# EasyEDA Pro project ProPrj_STM32电源板第二版_2025-04-22.epro, schematic Schematic1
Board Name: Board1; Create Date: 2025-03-05; Page Name: P1; Project Name: STM32电源板第二版; Schematic Name: Schematic1; Update Date: 2025-04-17; Company: 嘉立创EDA; Page Size: A4; Version: V1.0
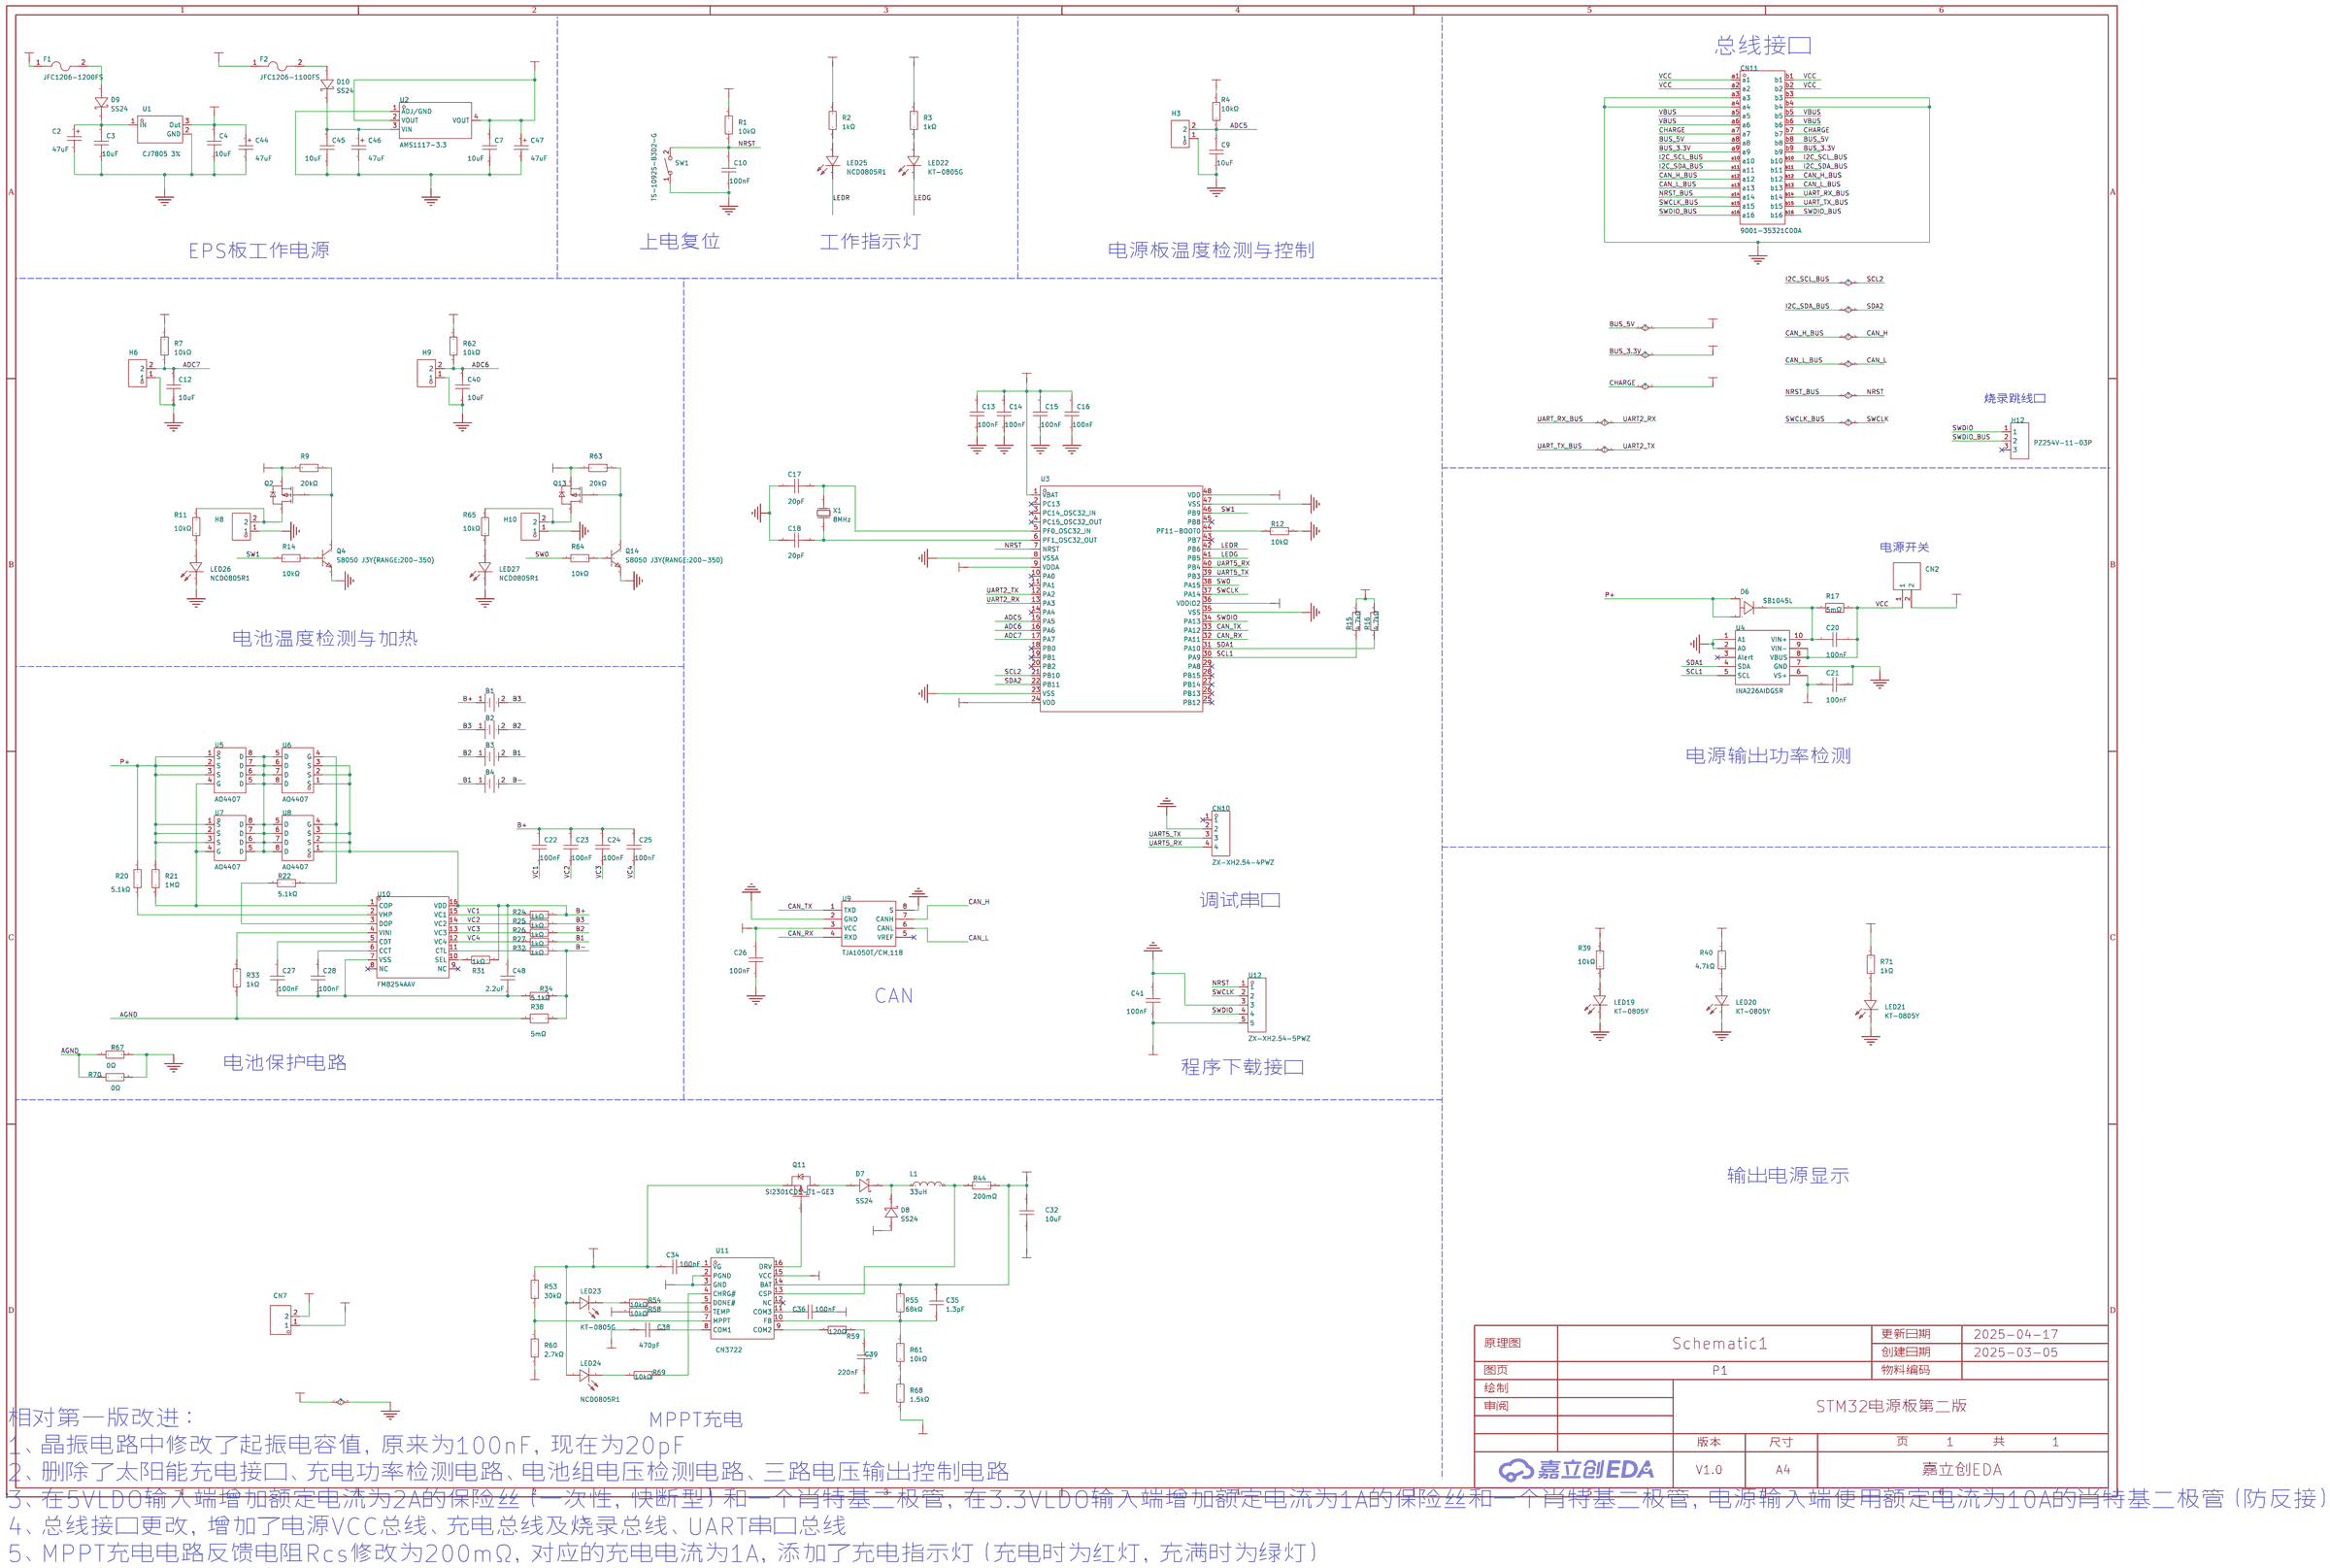
[diagram p0: schematic sheet]

## Parts
B1  -  [18650_ZHIHAN]
B2  -  [18650_ZHIHAN]
B3  -  [18650_ZHIHAN]
B4  -  [18650_ZHIHAN]
C2  47uF  [CASE-D_7343]
C3  10uF  [C0603]
C4  10uF  [C0603]
C7  10uF  [C0603]
C9  10uF  [C0603]
C10  100nF  [C0603]
C12  10uF  [C0603]
C13  100nF  [C0603]
C14  100nF  [C0603]
C15  100nF  [C0603]
C16  100nF  [C0603]
C17  20pF  [C0603]
C18  20pF  [C0603]
C20  100nF  [C0603]
C21  100nF  [C0603]
C22  100nF  [C0603]
C23  100nF  [C0603]
C24  100nF  [C0603]
C25  100nF  [C0603]
C26  100nF  [C0603]
C27  100nF  [C0603]
C28  100nF  [C0603]
C32  10uF  [C0603]
C34  100nF  [C0603]
C35  1.3pF  [C0603]
C36  100nF  [C0603]
C38  470pF  [C0603]
C39  220nF  [C0603]
C40  10uF  [C0603]
C41  100nF  [C0603]
C44  47uF  [CASE-D_7343]
C45  10uF  [C0603]
C46  47uF  [CASE-D_7343]
C47  47uF  [CASE-D_7343]
C48  2.2uF  [C0805]
CN2  WJ2EDGRC-5.08-2P  [CONN-TH_2P-P5.08_WJ2EDGRC-5.08-2P]
CN7  WJ15EDGRC-3.81-2P  [CONN-TH_2P-P3.81_WJ15EDGRC-3.81-2P]
CN10  ZX-XH2.54-4PWZ  [CONN-TH_4P-P2.50_ZX-XH2.54-4PWZ]
CN11  9001-35321C00A  [CONN-TH_32P-P2.54_9001-35321C00A]
D6  SB1045L  [TO-277_3P-L5.4-W4.0-LS6.5-TR]
D7  SS24  [SMA_L4.3-W2.6-LS5.0-FD]
D8  SS24  [SMA_L4.3-W2.6-LS5.0-FD]
D9  SS24  [SMA_L4.3-W2.6-LS5.0-FD]
D10  SS24  [SMA_L4.3-W2.6-LS5.0-FD]
F1  JFC1206-1200FS  [F1206]
F2  JFC1206-1100FS  [F1206]
H3  PZ254V-11-02P  [HDR-TH_2P-P2.54-V-M]
H6  PZ254V-11-02P  [HDR-TH_2P-P2.54-V-M]
H8  PZ254V-11-02P  [HDR-TH_2P-P2.54-V-M]
H9  PZ254V-11-02P  [HDR-TH_2P-P2.54-V-M]
H10  PZ254V-11-02P  [HDR-TH_2P-P2.54-V-M]
H12  PZ254V-11-03P  [HDR-TH_3P-P2.54-V-M]
L1  33uH  [IND-SMD_L7.0-W6.6_FXL0630]
LED19  KT-0805Y  [LED0805-R-RD]
LED20  KT-0805Y  [LED0805-R-RD]
LED21  KT-0805Y  [LED0805-R-RD]
LED22  KT-0805G  [LED0805-R-RD]
LED23  KT-0805G  [LED0805-R-RD]
LED24  NCD0805R1  [LED0805-R-RD]
LED25  NCD0805R1  [LED0805-R-RD]
LED26  NCD0805R1  [LED0805-R-RD]
LED27  NCD0805R1  [LED0805-R-RD]
Q2  SI2301CDS-T1-GE3  [SOT-23-3_L3.0-W1.7-P0.95-LS2.9-BR]
Q4  S8050 J3Y(RANGE:200-350)  [SOT-23-3_L3.0-W1.7-P0.95-LS2.9-BR]
Q11  SI2301CDS-T1-GE3  [SOT-23-3_L3.0-W1.7-P0.95-LS2.9-BR]
Q13  SI2301CDS-T1-GE3  [SOT-23-3_L3.0-W1.7-P0.95-LS2.9-BR]
Q14  S8050 J3Y(RANGE:200-350)  [SOT-23-3_L3.0-W1.7-P0.95-LS2.9-BR]
R1  10kΩ  [R0603]
R2  1kΩ  [R0603]
R3  1kΩ  [R0603]
R4  10kΩ  [R0603]
R7  10kΩ  [R0603]
R9  20kΩ  [R0603]
R11  10kΩ  [R0603]
R12  10kΩ  [R0603]
R14  10kΩ  [R0603]
R15  4.7kΩ  [R0603]
R16  4.7kΩ  [R0603]
R17  5mΩ  [RES-SMD_L6.4-W3.2-1]
R20  5.1kΩ  [R0603]
R21  1MΩ  [R0603]
R22  5.1kΩ  [R0603]
R24  1kΩ  [R0603]
R25  1kΩ  [R0603]
R26  1kΩ  [R0603]
R27  1kΩ  [R0603]
R31  1kΩ  [R0603]
R32  1kΩ  [R0603]
R33  1kΩ  [R0603]
R34  5.1kΩ  [R0603]
R38  5mΩ  [RES-SMD_L6.4-W3.2-1]
R39  10kΩ  [R0603]
R40  4.7kΩ  [R0603]
R44  200mΩ  [R0603]
R53  30kΩ  [R0603]
R54  10kΩ  [R0603]
R55  68kΩ  [R0805]
R58  10kΩ  [R0603]
R59  120Ω  [R0603]
R60  2.7kΩ  [R0603]
R61  10kΩ  [R0603]
R62  10kΩ  [R0603]
R63  20kΩ  [R0603]
R64  10kΩ  [R0603]
R65  10kΩ  [R0603]
R67  0Ω  [R0805]
R68  1.5kΩ  [R0603]
R69  10kΩ  [R0603]
R70  0Ω  [R0805]
R71  1kΩ  [R0603]
SW1  TS-1092S-B3D2-G  [SW-SMD_L6.1-W3.6-LS7.9]
U1  CJ7805 3%  [TO-252-2_L6.6-W6.1-P4.58-LS10.1-BR-CW]
U2  AMS1117-3.3  [SOT-223_L6.5-W3.5-P2.30-LS7.0-BR]
U3  STM32F091CCT6  [LQFP-48_L7.0-W7.0-P0.50-LS9.0-BL]
U4  INA226AIDGSR  [MSOP-10_L3.0-W3.0-P0.50-LS5.0-BL]
U5  AO4407  [SOP-8_L4.9-W3.9-P1.27-LS6.0-BL-1]
U6  AO4407  [SOP-8_L4.9-W3.9-P1.27-LS6.0-BL-1]
U7  AO4407  [SOP-8_L4.9-W3.9-P1.27-LS6.0-BL-1]
U8  AO4407  [SOP-8_L4.9-W3.9-P1.27-LS6.0-BL-1]
U9  TJA1050T/CM,118  [SOIC-8_L5.0-W4.0-P1.27-LS6.0-BL]
U10  FM8254AAV  [TSSOP-16_L5.0-W4.4-P0.65-LS6.4-BL]
U11  CN3722  [TSSOP-16_L5.0-W4.4-P0.65-LS6.4-BL]
U12  ZX-XH2.54-5PWZ  [CONN-TH_ZX-XH2.54-5PWZ]
X1  8MHz  [CRYSTAL-SMD_L5.0-W3.2]

## Library data of the parts
B1-B4 = 18650_ZHIHAN
C2 C44 C46 C47 = TAJD476K025RNJ: 容值:47uF;精度:±10%;额定电压:25V;等效串联电阻:900mΩ@100kHz;; LCSC Part Name: 47uF ±10% 25V; Supplier Part: C7228; Manufacturer: Kyocera AVX; Supplier Footprint: CASE-D-7343; JLCPCB Part Class: 扩展库; Datasheet: https://atta.szlcsc.com/upload/public/pdf/source/20160107/1457707750344.pdf; Supplier: LCSC; Tolerance: ±10%; Rated Voltage: 25V; Equivalent Series Resistance(ESR): 900mΩ@100kHz; Operating Temperature: -55℃~+125℃
C3 C4 C7 C9 C12 C32 C40 C45 = CL10A106MA8NRNC: 容值:10uF;精度:±20%;额定电压:25V;材质(温度系数):X5R;; LCSC Part Name: 10uF ±20% 25V; Supplier Part: C96446; Manufacturer: SAMSUNG(三星); Supplier Footprint: 0603; JLCPCB Part Class: Basic Part; Datasheet: https://atta.szlcsc.com/upload/public/pdf/source/20160218/1457707763339.pdf; Supplier: LCSC; Tolerance: ±20%; Voltage Rated: 25V; Temperature Coefficient: X5R
C10 C13-C16 C22-C28 C34 C36 C41 = CC0603KRX7R9BB104: 容值:100nF;精度:±10%;额定电压:50V;材质(温度系数):X7R;; LCSC Part Name: 100nF ±10% 50V; Supplier Part: C14663; Manufacturer: YAGEO(国巨); Supplier Footprint: 0603; JLCPCB Part Class: 基础库; Datasheet: https://atta.szlcsc.com/upload/public/pdf/source/20180910/C282072_33301C7F631E79921B82A8DAC6BCC5B3.pdf; Supplier: LCSC; Tolerance: ±10%; Voltage Rated: 50V; Temperature Coefficient: X7R
C17 C18 = CL10C200JB8NNNC: 容值:20pF;精度:±5%;额定电压:50V;材质(温度系数):C0G;; LCSC Part Name: 20pF ±5% 50V; Supplier Part: C1648; Manufacturer: SAMSUNG(三星); Supplier Footprint: 0603; JLCPCB Part Class: Basic Part; Datasheet: https://atta.szlcsc.com/upload/public/pdf/source/20160218/1457707763339.pdf; Supplier: LCSC; Tolerance: ±5%; Voltage Rated: 50V; Temperature Coefficient: C0G
C20 C21 = CC0603KRX7R9BB104: 容值:100nF;精度:±10%;额定电压:50V;材质(温度系数):X7R;; LCSC Part Name: 100nF ±10% 50V; Supplier Part: C14663; Manufacturer: YAGEO(国巨); Supplier Footprint: 0603; JLCPCB Part Class: Basic Part; Datasheet: https://atta.szlcsc.com/upload/public/pdf/source/20180910/C282072_33301C7F631E79921B82A8DAC6BCC5B3.pdf; Supplier: LCSC; Tolerance: ±10%; Voltage Rated: 50V; Temperature Coefficient: X7R
C35 = CC0603BRNPO9BN1R3: 容值:1.3pF;额定电压:50V;材质(温度系数):NP0;; LCSC Part Name: 1.3pF 50V ±0.1pF; Supplier Part: C519099; Manufacturer: YAGEO(国巨); Supplier Footprint: 0603; JLCPCB Part Class: Extended Part; Datasheet: https://atta.szlcsc.com/upload/public/pdf/source/20200423/C519099_8AE179EFC308FDA893C1E2B4B727B3A4.pdf; Supplier: LCSC; Voltage Rated: 50V; Temperature Coefficient: NP0
C38 = 0603B471K500NT: 容值:470pF;精度:±10%;额定电压:50V;材质(温度系数):X7R;; LCSC Part Name: 470pF ±10% 50V; Supplier Part: C1620; Manufacturer: FH(风华); Supplier Footprint: 0603; JLCPCB Part Class: Basic Part; Datasheet: https://atta.szlcsc.com/upload/public/pdf/source/20200305/C486355_26A10D38EF8C2A5C37091D0039909270.pdf; Supplier: LCSC; Tolerance: ±10%; Voltage Rated: 50V; Temperature Coefficient: X7R
C39 = CL10B224KA8NNNC: 容值:220nF;精度:±10%;额定电压:25V;材质(温度系数):X7R;; LCSC Part Name: 220nF ±10% 25V; Supplier Part: C21120; Manufacturer: SAMSUNG(三星); Supplier Footprint: 0603; JLCPCB Part Class: Basic Part; Datasheet: https://atta.szlcsc.com/upload/public/pdf/source/20160218/1457707763339.pdf; Supplier: LCSC; Tolerance: ±10%; Voltage Rated: 25V; Temperature Coefficient: X7R
C48 = CL21A225KBQNNNE: 容值:2.2uF;精度:±10%;额定电压:50V;材质(温度系数):X5R;; LCSC Part Name: 2.2uF ±10% 50V; Supplier Part: C377773; Manufacturer: SAMSUNG(三星); Supplier Footprint: 0805; JLCPCB Part Class: Basic Part; Datasheet: https://atta.szlcsc.com/upload/public/pdf/source/20160218/1457707763339.pdf; Supplier: LCSC; Tolerance: ±10%; Voltage Rated: 50V; Temperature Coefficient: X5R
CN2 = WJ2EDGRC-5.08-2P: 连接器类型:板端/插座-闭口;结构:1x2P;间距:5.08mm;颜色:绿色;安装方式:弯针;排数:1;每排PIN数:2;; LCSC Part Name: 5.08mm 1x2P 排数:1 每排P数:2; Supplier Part: C3697; Manufacturer: KANGNEX(康奈克斯电气); Supplier Footprint: 弯插,P=5.08mm; JLCPCB Part Class: 扩展库; Datasheet: https://atta.szlcsc.com/upload/public/pdf/source/20191225/C3697_6E7B45CD3FD3DA2CDF6A2CE707235E10.pdf; Supplier: LCSC; Connector Type: 板端/插座-闭口; Structure: 1x2P; Pitch: 5.08mm; Color: 绿色; Mounting Style: 弯针; Number of Pins: 2P; Number of Rows: 1; Number of PINs Per Row: 2
CN7 = WJ15EDGRC-3.81-2P: 连接器类型:板端/插座-闭口;结构:1x2P;间距:3.81mm;颜色:绿色;安装方式:弯针;排数:1;每排PIN数:2;; LCSC Part Name: 3.81mm 1x2P 排数:1 每排P数:2; Supplier Part: C8387; Manufacturer: KANGNEX(康奈克斯电气); Supplier Footprint: 弯插,P=3.81mm; JLCPCB Part Class: 扩展库; Datasheet: https://atta.szlcsc.com/upload/public/pdf/source/20191225/C8387_8EBAF10345D2762F0167C8753398EEFA.pdf; Supplier: LCSC; Connector Type: 板端/插座-闭口; Structure: 1x2P; Pitch: 3.81mm; Color: 绿色; Mounting Style: 弯针; Number of Rows: 1; Number of PINs Per Row: 2
CN10 = ZX-XH2.54-4PWZ: 插针结构:1x4P;间距:2.54mm;安装方式:弯插;参考系列:XH;总PIN数:4P;排数:1;每排PIN数:4;行距:-;额定电流:3A;触头材质:黄铜;触头镀层:锡;工作温度范围:-25℃~+85℃;; LCSC Part Name: 配套胶壳型号：ZX-XH2.54-4PJK 配套端子型号：ZX-XH2.54-DZ 配套杜邦线型号：ZX-XH2.54-4PBXC; Supplier Part: C7429643; Manufacturer: Megastar(兆星); Supplier Footprint: 弯插,P=2.54mm; JLCPCB Part Class: 扩展库; Datasheet: https://atta.szlcsc.com/upload/public/pdf/source/20230619/8DC602C7BA46C153FF1BE89D90453879.pdf; Supplier: LCSC; Pins Structure: 1x4P; Pitch: 2.54mm; Mounting Style: 弯插; Reference Series: XH; Number of Pins: 4P; Number of Rows: 1; Number of PINs Per Row: 4; Current Rating (Max): 3A; Contact Material: 黄铜; Contact Plating: 锡; Operating Temperature Range: -25℃~+85℃
CN11 = 9001-35321C00A: Supplier Part: C5173389; Manufacturer: WingTAT(格林柏); Supplier Footprint: 弯插,P=2.54mm; JLCPCB Part Class: 扩展库; Datasheet: https://atta.szlcsc.com/upload/public/pdf/source/20220930/6F5D259D0E345A9F0D7DF594CFB3CC0F.pdf; Supplier: LCSC
D6 = SB1045L_C908747: 二极管配置:独立式;正向压降(Vf):530mV@10A;直流反向耐压(Vr):45V;整流电流:10A;; LCSC Part Name: 电压:45V 电流:10A; Supplier Part: C908747; Manufacturer: GOODWORK(固得沃克); Supplier Footprint: TO-277; JLCPCB Part Class: 扩展库; Datasheet: https://atta.szlcsc.com/upload/public/pdf/source/20240805/CD6D547625B04EA7D0513DDBB141E9CE.pdf; Supplier: LCSC; Diode Configuration: 独立式; Voltage - Forward(Vf@If): 530mV@10A; Voltage - DC Reverse(Vr): 45V; Current - Rectified: 10A; Reverse Leakage Current (Ir): 150uA
D7-D10 = SS24_C7420362: 二极管配置:独立式;正向压降(Vf):550mV@1.0A;直流反向耐压(Vr):40V;整流电流:2A;; LCSC Part Name: 电压:40V 电流:2A; Supplier Part: C7420362; Manufacturer: 宏迦橙; Supplier Footprint: SMA(DO-214AC); JLCPCB Part Class: 扩展库; Datasheet: https://atta.szlcsc.com/upload/public/pdf/source/20230828/2D67628D7EFDC2DD386D167E8AEA232D.pdf; Supplier: LCSC; Diode Configuration: 独立式; Forward Voltage (Vf@If): 550mV@1.0A; Reverse Voltage (Vr): 40V; Rectified Current: 2A; Reverse Leakage Current (Ir): 200uA@40V
F1 = JFC1206-1200FS: 类型:贴片式保险丝;额定电流:2A;额定电压 (AC):63V;额定电压:63V;分断能力:50A;; LCSC Part Name: 贴片式保险丝; Supplier Part: C136345; Manufacturer: JDTfuse(集电通); Supplier Footprint: 1206; JLCPCB Part Class: 扩展库; Datasheet: https://atta.szlcsc.com/upload/public/pdf/source/20230515/8A56624F973AA51D74CDD59D07A1FF42.pdf; Supplier: LCSC; Type: 贴片式保险丝; Current Rating: 2A; Voltage Rating (AC): 63V; Voltage Rating (DC): 63V; Operating Temperature: -55℃~+125℃; Interrupt Rating: 50A
F2 = JFC1206-1100FS: 类型:贴片式保险丝;额定电流:1A;额定电压 (AC):-;额定电压:63V;分断能力:50A;; LCSC Part Name: 贴片式保险丝; Supplier Part: C136343; Manufacturer: JDTfuse(集电通); Supplier Footprint: 1206; JLCPCB Part Class: 扩展库; Datasheet: https://atta.szlcsc.com/upload/public/pdf/source/20230515/8A56624F973AA51D74CDD59D07A1FF42.pdf; Supplier: LCSC; Type: 贴片式保险丝; Current Rating: 1A; Voltage Rating (DC): 63V; Operating Temperature: -55℃~+125℃; Interrupt Rating: 50A
H3 H6 H8-H10 = PZ254V-11-02P: 插针结构:1x2P;间距:2.54mm;行距:-;圆针/方针:方针;安装类型:直插;排数:单排;总PIN位数:2P;额定电流:-;额定电压:-;配合针长度:6mm;塑高:2.5mm;端接针长度:3mm;触头材质:黄铜;触头镀层:-;工作温度范围:-40℃~+105℃;颜色:黑色;; LCSC Part Name: 间距:2.54mm 1x2P 直插 方针; Supplier Part: C492401; Manufacturer: XFCN(兴飞); Supplier Footprint: 插件,P=2.54mm; JLCPCB Part Class: 扩展库; Datasheet: https://atta.szlcsc.com/upload/public/pdf/source/20200309/C492401_A812433581A9B211A7FFA413ADDFF0E5.pdf; Supplier: LCSC; Pin Structure: 1x2P; Pitch: 2.54mm; Circluar Pins/Square Pins: 方针; Mounting Type: 直插; Number of Rows: 单排; Number of Pins: 2P; Length of Mating Pin: 6mm; Insulation Height: 2.5mm; Length of End Connection Pin: 3mm; Contact Material: 黄铜; Operating Temperature Range: -40℃~+105℃; Color: 黑色
H12 = PZ254V-11-03P: 插针结构:1x3P;间距:2.54mm;行距:-;圆针/方针:方针;安装方式:直插;排数:单排;总PIN位数:3P;额定电流:3A;额定电压:250V;配合针长度:6mm;塑高:2.5mm;端接针长度:3mm;工作温度:-40℃~+105℃;颜色:黑色;; LCSC Part Name: 1x3P 间距:2.54mm 方针 直插; Supplier Part: C2937625; Manufacturer: XFCN(兴飞); Supplier Footprint: 插件,P=2.54mm; JLCPCB Part Class: 扩展库; Datasheet: https://atta.szlcsc.com/upload/public/pdf/source/20200309/C492402_8335C3D49C4E4C618838D59BB1D024C1.pdf; Supplier: LCSC; Pin Structure: 1x3P; Pitch: 2.54mm; Circluar Pins/Square Pins: 方针; Mounting Type: 直插; Number of Rows: 单排; Number of Pins: 3P; Current Rating: 3A; Voltage Rating (Max): 250V; Length of Mating Pin: 6mm; Insulation Height: 2.5mm; Length of End Connection Pin: 3mm; Operating Temperature: -40℃~+105℃; Color: 黑色
L1 = FXL0630-330-M: 电感值:33uH;精度:±20%;额定电流:2A;饱和电流(Isat):2.5A;类型:一体成型电感;; LCSC Part Name: 33uH ±20% 2.5A; Supplier Part: C177245; Manufacturer: cjiang(长江微电); Supplier Footprint: SMD,6.6x7mm; JLCPCB Part Class: Extended Part; Datasheet: https://atta.szlcsc.com/upload/public/pdf/source/20240426/3189EA8206330E2108542F9E34E540E7.pdf; Supplier: LCSC; Tolerance: ±20%; Rated Current: 2A; Saturation Current (Isat): 2.5A; DC Resistance (DCR): 310mΩ; Type: 一体成型电感
LED19-LED21 = KT-0805Y: 发光颜色:黄色;功率:-;正向电流:-;主波长:-;二极管配置:-;透镜颜色:-;色温:-;发光角度:-;载带方式:-;工作温度:-;; LCSC Part Name: 0805 黄灯 高亮; Supplier Part: C2296; Manufacturer: KENTO; Supplier Footprint: 0805; JLCPCB Part Class: Basic Part; Datasheet: https://atta.szlcsc.com/upload/public/pdf/source/20160421/1461205044170.pdf; Supplier: LCSC; Emitted Color: 黄色
LED22 LED23 = KT-0805G: 灯头类型:-;发光颜色:翠绿色;正向电压(VF):-;功率:-;正向电流:-;主波长:-;二极管配置:-;透镜颜色:-;色温:-;发光强度:-;发光角度:-;载带方式:-;工作温度:-;; LCSC Part Name: 0805 翠绿 高亮; Supplier Part: C2297; Manufacturer: KENTO; Supplier Footprint: 0805; JLCPCB Part Class: Basic Part; Datasheet: https://atta.szlcsc.com/upload/public/pdf/source/20170209/1486607340485.pdf; Supplier: LCSC; Emitted Color: 翠绿色
LED24-LED27 = NCD0805R1: 灯头类型:-;发光颜色:红色;正向电压(VF):1.6V~2.6V;功率:65mW;正向电流:20mA;主波长:615nm~630nm;二极管配置:独立二极管;透镜颜色:无色透明透镜;色温:-;发光强度:67mcd~195mcd;发光角度:130°;载带方式:-;工作温度:-30℃~+85℃;; Supplier Part: C84256; Manufacturer: 国星光电; Supplier Footprint: 0805; JLCPCB Part Class: 基础库; Datasheet: https://atta.szlcsc.com/upload/public/pdf/source/20200820/C84256_F0A75A43B3EAD75808600A0514C76B99.pdf; Supplier: LCSC; Emitted Color: 红色; Forward Voltage (VF): 1.6V~2.6V; Power Dissipation: 65mW; Forward Current: 20mA; Dominant Wavelength: 615nm~630nm; Diode Configuration: 独立二极管; Lens Color: 无色透明透镜; Luminous Intensity: 67mcd~195mcd; Viewing Angle: 130°; Operating Temperature: -30℃~+85℃
Q2 Q11 Q13 = SI2301CDS-T1-GE3: 类型:1个P沟道;漏源电压(Vdss):20V;连续漏极电流(Id):2.3A;导通电阻(RDS(on)@Vgs,Id):112mΩ@4.5V,2.8A;功率(Pd):860mW;阈值电压(Vgs(th)@Id):1V@250uA;; LCSC Part Name: 1个P沟道 耐压:20V 电流:2.3A; Supplier Part: C10487; Manufacturer: VISHAY(威世); Supplier Footprint: SOT-23; JLCPCB Part Class: Basic Part; Datasheet: https://atta.szlcsc.com/upload/public/pdf/source/20180621/C10487_757133A2CC00440C4C7DD3E7E73681E9.pdf; Supplier: LCSC; Type: 1个P沟道; Drain Source Voltage (Vdss): 20V; Continuous Drain Current (Id): 2.3A; Drain Source On Resistance (RDS(on)@Vgs,Id): 112mΩ@4.5V,2.8A; Power Dissipation (Pd): 860mW; Gate Threshold Voltage (Vgs(th)@Id): 1V@250uA; Total Gate Charge (Qg@Vgs): 3.3nC@10V; Input Capacitance (Ciss@Vds): 405pF@10V; Reverse Transfer Capacitance (Crss@Vds): 55pF@10V; Operating Temperature: -55℃~+150℃
Q4 Q14 = S8050 J3Y(RANGE:200-350): 晶体管类型:NPN;集电极电流(Ic):500mA;集射极击穿电压(Vceo):25V;功率(Pd):300mW;直流电流增益(hFE@Ic,Vce):200@500mA,1V;; LCSC Part Name: NPN 电流:500mA 耐压:25V H档(200-350); Supplier Part: C2146; Manufacturer: CJ(江苏长电/长晶); Supplier Footprint: SOT-23; JLCPCB Part Class: Basic Part; Datasheet: https://atta.szlcsc.com/upload/public/pdf/source/20231013/FF37B6A000E6CDA75C9C999D2E78731F.pdf; Supplier: LCSC; Transistor Type: NPN; Collector Current (Ic): 500mA; Collector-Emitter Breakdown Voltage (Vceo): 25V; Power Dissipation (Pd): 300mW; DC Current Gain (hFE@Ic,Vce): 200@500mA,1V; Transition Frequency (fT): 150MHz; Collector Cut-Off Current (Icbo): 100nA; Collector-Emitter Saturation Voltage (VCE(sat)@Ic,Ib): 600mV@500mA,50mA; Operating Temperature: -55℃~+150℃
R1 R7 R11 R12 R14 R39 R54 R58 R62 R64 R65 R69 = 0603WAF1002T5E: 电阻类型:厚膜电阻;阻值:10kΩ;精度:±1%;功率:100mW;最大工作电压:75V;温度系数:±100ppm/℃;; LCSC Part Name: 厚膜电阻 10kΩ ±1% 100mW; Supplier Part: C25804; Manufacturer: UNI-ROYAL(厚声); Supplier Footprint: 0603; JLCPCB Part Class: 基础库; Datasheet: https://atta.szlcsc.com/upload/public/pdf/source/20200306/C422600_1E6D84923E4A46A82E41ADD87F860B5C.pdf; Supplier: LCSC; Type: 厚膜电阻; Tolerance: ±1%; Power(Watts): 100mW; Overload Voltage (Max): 75V; Temperature Coefficient: ±100ppm/℃; Operating Temperature Range: -55℃~+155℃
R2 R3 R24-R27 R31-R33 R71 = 0603WAF1001T5E: 电阻类型:厚膜电阻;阻值:1kΩ;精度:±1%;功率:100mW;最大工作电压:75V;温度系数:±100ppm/℃;; LCSC Part Name: 1kΩ ±1% 100mW 厚膜电阻; Supplier Part: C21190; Manufacturer: UNI-ROYAL(厚声); Supplier Footprint: 0603; JLCPCB Part Class: Basic Part; Datasheet: https://atta.szlcsc.com/upload/public/pdf/source/20200306/C422600_1E6D84923E4A46A82E41ADD87F860B5C.pdf; Supplier: LCSC; Type: 厚膜电阻; Tolerance: ±1%; Power(Watts): 100mW; Overload Voltage (Max): 75V; Temperature Coefficient: ±100ppm/℃; Operating Temperature Range: -55℃~+155℃
R4 R61 = 0603WAF1002T5E: 电阻类型:厚膜电阻;阻值:10kΩ;精度:±1%;功率:100mW;最大工作电压:75V;温度系数:±100ppm/℃;; LCSC Part Name: 厚膜电阻 10kΩ ±1% 100mW; Supplier Part: C25804; Manufacturer: UNI-ROYAL(厚声); Supplier Footprint: 0603; JLCPCB Part Class: Basic Part; Datasheet: https://atta.szlcsc.com/upload/public/pdf/source/20200306/C422600_1E6D84923E4A46A82E41ADD87F860B5C.pdf; Supplier: LCSC; Type: 厚膜电阻; Tolerance: ±1%; Power(Watts): 100mW; Overload Voltage (Max): 75V; Temperature Coefficient: ±100ppm/℃; Operating Temperature Range: -55℃~+155℃
R9 R63 = 0603WAF2002T5E: 电阻类型:厚膜电阻;阻值:20kΩ;精度:±1%;功率:100mW;最大工作电压:75V;温度系数:±100ppm/℃;; LCSC Part Name: 20kΩ ±1% 100mW 厚膜电阻; Supplier Part: C4184; Manufacturer: UNI-ROYAL(厚声); Supplier Footprint: 0603; JLCPCB Part Class: Basic Part; Datasheet: https://atta.szlcsc.com/upload/public/pdf/source/20200306/C422600_1E6D84923E4A46A82E41ADD87F860B5C.pdf; Supplier: LCSC; Type: 厚膜电阻; Tolerance: ±1%; Power(Watts): 100mW; Overload Voltage (Max): 75V; Temperature Coefficient: ±100ppm/℃; Operating Temperature Range: -55℃~+155℃
R15 R16 R40 = 0603WAF4701T5E: 电阻类型:厚膜电阻;阻值:4.7kΩ;精度:±1%;功率:100mW;最大工作电压:75V;温度系数:±100ppm/℃;; LCSC Part Name: 4.7kΩ ±1% 100mW 厚膜电阻; Supplier Part: C23162; Manufacturer: UNI-ROYAL(厚声); Supplier Footprint: 0603; JLCPCB Part Class: Basic Part; Datasheet: https://atta.szlcsc.com/upload/public/pdf/source/20200306/C422600_1E6D84923E4A46A82E41ADD87F860B5C.pdf; Supplier: LCSC; Type: 厚膜电阻; Tolerance: ±1%; Power(Watts): 100mW; Overload Voltage (Max): 75V; Temperature Coefficient: ±100ppm/℃; Operating Temperature Range: -55℃~+155℃
R17 R38 = HoJLR2512-3W-5mR-1%: 电阻类型:采样电阻;阻值:5mΩ;精度:±1%;功率:3W;安装方式:贴片;; LCSC Part Name: 5mΩ ±1% 3W; Supplier Part: C2903482; Manufacturer: Milliohm(毫欧); Supplier Footprint: 2512; JLCPCB Part Class: Extended Part; Datasheet: https://atta.szlcsc.com/upload/public/pdf/source/20211009/7525CABAB363C979E942C1DD41F1FEF0.pdf; Supplier: LCSC; Type: 采样电阻; Tolerance: ±1%; Power(Watts): 3W; Mounting Sytle: 贴片
R20 R22 R34 = 0603WAF5101T5E: 电阻类型:厚膜电阻;阻值:5.1kΩ;精度:±1%;功率:100mW;最大工作电压:75V;温度系数:±100ppm/℃;; LCSC Part Name: 5.1kΩ ±1% 100mW 厚膜电阻; Supplier Part: C23186; Manufacturer: UNI-ROYAL(厚声); Supplier Footprint: 0603; JLCPCB Part Class: Basic Part; Datasheet: https://atta.szlcsc.com/upload/public/pdf/source/20200306/C422600_1E6D84923E4A46A82E41ADD87F860B5C.pdf; Supplier: LCSC; Type: 厚膜电阻; Tolerance: ±1%; Power(Watts): 100mW; Overload Voltage (Max): 75V; Temperature Coefficient: ±100ppm/℃; Operating Temperature Range: -55℃~+155℃
R21 = 0603WAF1004T5E: 电阻类型:厚膜电阻;阻值:1MΩ;精度:±1%;功率:100mW;最大工作电压:75V;温度系数:±100ppm/℃;; LCSC Part Name: 1MΩ ±1% 100mW 厚膜电阻; Supplier Part: C22935; Manufacturer: UNI-ROYAL(厚声); Supplier Footprint: 0603; JLCPCB Part Class: Basic Part; Datasheet: https://atta.szlcsc.com/upload/public/pdf/source/20200306/C422600_1E6D84923E4A46A82E41ADD87F860B5C.pdf; Supplier: LCSC; Type: 厚膜电阻; Tolerance: ±1%; Power(Watts): 100mW; Overload Voltage (Max): 75V; Temperature Coefficient: ±100ppm/℃; Operating Temperature Range: -55℃~+155℃
R44 = 0603WAF200LT5E: 电阻类型:厚膜电阻;阻值:200mΩ;精度:±1%;功率:100mW;最大工作电压:75V;温度系数:±800ppm/℃;; LCSC Part Name: 200mΩ ±1% 100mW 厚膜电阻; Supplier Part: C79773; Manufacturer: UNI-ROYAL(厚声); Supplier Footprint: 0603; JLCPCB Part Class: Extended Part; Datasheet: https://atta.szlcsc.com/upload/public/pdf/source/20200306/C422600_1E6D84923E4A46A82E41ADD87F860B5C.pdf; Supplier: LCSC; Type: 厚膜电阻; Tolerance: ±1%; Power(Watts): 100mW; Overload Voltage (Max): 75V; Temperature Coefficient: ±800ppm/℃; Operating Temperature Range: -55℃~+155℃
R53 = 0603WAF3002T5E: 电阻类型:厚膜电阻;阻值:30kΩ;精度:±1%;功率:100mW;最大工作电压:75V;温度系数:±100ppm/℃;; LCSC Part Name: 30kΩ ±1% 100mW 厚膜电阻; Supplier Part: C22984; Manufacturer: UNI-ROYAL(厚声); Supplier Footprint: 0603; JLCPCB Part Class: Basic Part; Datasheet: https://atta.szlcsc.com/upload/public/pdf/source/20200306/C422600_1E6D84923E4A46A82E41ADD87F860B5C.pdf; Supplier: LCSC; Type: 厚膜电阻; Tolerance: ±1%; Power(Watts): 100mW; Overload Voltage (Max): 75V; Temperature Coefficient: ±100ppm/℃; Operating Temperature Range: -55℃~+155℃
R55 = 0805W8F6802T5E: 电阻类型:厚膜电阻;阻值:68kΩ;精度:±1%;功率:125mW;最大工作电压:150V;温度系数:±100ppm/℃;; LCSC Part Name: 68kΩ ±1% 125mW 厚膜电阻; Supplier Part: C17801; Manufacturer: UNI-ROYAL(厚声); Supplier Footprint: 0805; JLCPCB Part Class: Basic Part; Datasheet: https://atta.szlcsc.com/upload/public/pdf/source/20200306/C422600_1E6D84923E4A46A82E41ADD87F860B5C.pdf; Supplier: LCSC; Type: 厚膜电阻; Tolerance: ±1%; Power(Watts): 125mW; Overload Voltage (Max): 150V; Temperature Coefficient: ±100ppm/℃; Operating Temperature Range: -55℃~+155℃
R59 = 0603WAF1200T5E: 电阻类型:厚膜电阻;阻值:120Ω;精度:±1%;功率:100mW;最大工作电压:75V;温度系数:±100ppm/℃;; LCSC Part Name: 120Ω ±1% 100mW 厚膜电阻; Supplier Part: C22787; Manufacturer: UNI-ROYAL(厚声); Supplier Footprint: 0603; JLCPCB Part Class: 基础库; Datasheet: https://atta.szlcsc.com/upload/public/pdf/source/20200306/C422600_1E6D84923E4A46A82E41ADD87F860B5C.pdf; Supplier: LCSC; Type: 厚膜电阻; Tolerance: ±1%; Power(Watts): 100mW; Overload Voltage (Max): 75V; Temperature Coefficient: ±100ppm/℃; Operating Temperature Range: -55℃~+155℃
R60 = 0603WAF2701T5E: 电阻类型:厚膜电阻;阻值:2.7kΩ;精度:±1%;功率:100mW;最大工作电压:75V;温度系数:±100ppm/℃;; LCSC Part Name: 2.7kΩ ±1% 100mW 厚膜电阻; Supplier Part: C13167; Manufacturer: UNI-ROYAL(厚声); Supplier Footprint: 0603; JLCPCB Part Class: Basic Part; Datasheet: https://atta.szlcsc.com/upload/public/pdf/source/20200306/C422600_1E6D84923E4A46A82E41ADD87F860B5C.pdf; Supplier: LCSC; Type: 厚膜电阻; Tolerance: ±1%; Power(Watts): 100mW; Overload Voltage (Max): 75V; Temperature Coefficient: ±100ppm/℃; Operating Temperature Range: -55℃~+155℃
R67 R70 = 0805W8F0000T5E: 电阻类型:厚膜电阻;阻值:0Ω;精度:±1%;功率:125mW;最大工作电压:150V;温度系数:±800ppm/℃;; LCSC Part Name: 0Ω ±1% 125mW 厚膜电阻; Supplier Part: C17477; Manufacturer: UNI-ROYAL(厚声); Supplier Footprint: 0805; JLCPCB Part Class: 基础库; Datasheet: https://atta.szlcsc.com/upload/public/pdf/source/20200306/C422600_1E6D84923E4A46A82E41ADD87F860B5C.pdf; Supplier: LCSC; Type: 厚膜电阻; Tolerance: ±1%; Power(Watts): 125mW; Overload Voltage (Max): 150V; Temperature Coefficient: ±800ppm/℃; Operating Temperature Range: -55℃~+155℃
R68 = 0603WAF1501T5E: 电阻类型:厚膜电阻;阻值:1.5kΩ;精度:±1%;功率:100mW;最大工作电压:75V;温度系数:±100ppm/℃;; LCSC Part Name: 1.5kΩ ±1% 100mW 厚膜电阻; Supplier Part: C22843; Manufacturer: UNI-ROYAL(厚声); Supplier Footprint: 0603; JLCPCB Part Class: Basic Part; Datasheet: https://atta.szlcsc.com/upload/public/pdf/source/20200306/C422600_1E6D84923E4A46A82E41ADD87F860B5C.pdf; Supplier: LCSC; Type: 厚膜电阻; Tolerance: ±1%; Power(Watts): 100mW; Overload Voltage (Max): 75V; Temperature Coefficient: ±100ppm/℃; Operating Temperature Range: -55℃~+155℃
SW1 = TS-1092S-B3D2-G: 电路结构:单刀单掷;按钮形状:矩形按钮;作用力:250gf;安装方式:立贴;开关长度:6.1mm;开关宽度:3.6mm;开关高度:2.5mm;带支架:不带;机械寿命:-;; LCSC Part Name: 6.1*3.6*2.5mm 立贴 轻触开关; Supplier Part: C520860; Manufacturer: Yuandi(元迪); Supplier Footprint: SMD; JLCPCB Part Class: 扩展库; Datasheet: https://atta.szlcsc.com/upload/public/pdf/source/20200424/C520860_DA5AE47D9A9DC527FC720B5FF0895739.pdf; Supplier: LCSC; Circuit: 单刀单掷; Actuator Style: 矩形按钮; Operating Force: 250gf; Mounting Style: 立贴; Switch Length: 6.1mm; Switch Width: 3.6mm; Switch Height: 2.5mm; Strike Gundam: 不带; Actuator/Cap Color: 灰色; Pin Style: 鸥翼型
U1 = CJ7805 3%: 输出类型:固定;最大输入电压:35V;输出电压:5V;最大输出电流:1.5A;输出极性:正极;; LCSC Part Name: 输入35V 输出5V 1.5A; Supplier Part: C21706; Manufacturer: CJ(江苏长电/长晶); Supplier Footprint: TO-252-2(DPAK); JLCPCB Part Class: 扩展库; Datasheet: https://atta.szlcsc.com/upload/public/pdf/source/20171228/C164904_15144413121361213907.pdf; Supplier: LCSC; Output Type: 固定; Maximum Input Voltage: 35V; Output Voltage: 5V; MAX Output Current: 1.5A; Dropout Voltage: 2V@(1A); Output Polarity: 正极; Number of Outputs: 1
U2 = AMS1117-3.3_C426566: 输出类型:固定;最大输入电压:18V;输出电压:3.3V;最大输出电流:1A;电源纹波抑制比(PSRR):70dB@(120Hz);输出极性:正极;; LCSC Part Name: 输入18V 输出3.3V 1A; Supplier Part: C426566; Manufacturer: Slkor(萨科微); Supplier Footprint: SOT-223; JLCPCB Part Class: 扩展库; Datasheet: https://atta.szlcsc.com/upload/public/pdf/source/20201231/C426566_7F22DB93439D00F3FA27143E4F28C6AA.pdf; Supplier: LCSC; Output Type: 固定; Maximum Input Voltage: 18V; Output Voltage: 3.3V; MAX Output Current: 1A; Power Supply Rejection Ratio (PSRR): 70dB@(120Hz); Dropout Voltage: 1.4V@(1A); Output Polarity: 正极; Number of Outputs: 1
U3 = STM32F091CCT6: CPU内核:CM0;程序存储容量:256KB;RAM总容量:32KB;GPIO端口数量:38;工作电压范围:2V~3.6V;CPU最大主频:48MHz;程序存储器类型:FLASH;; Supplier Part: C129795; Manufacturer: ST(意法半导体); Supplier Footprint: LQFP-48(7x7); JLCPCB Part Class: 扩展库; Datasheet: https://atta.szlcsc.com/upload/public/pdf/source/20180517/C221479_C13444D30F0CF2C3B81BD499DDA9A6A1.pdf; Supplier: LCSC; CPU Core: CM0; Program Storage Size: 256KB; RAM Size: 32KB; GPIO Ports Number: 38; Operating Voltage Range: 2V~3.6V; CPU Maximum Speed: 48MHz; Program Memory Type: FLASH; Operating Temperature Range: -40℃~+85℃; ADC (Bit): 12bit; DAC (Bit): 12bit; Peripheral/Function: DMA；PWM; Watchdog: 有; Infrared Data Association: 有; Low-Voltage Detect: 有; Direct Memory Access: 有; Internal Oscillator: 有
U4 = INA226AIDGSR: INA226 支持报警功能的 36V、双向、超高精度、低侧/高侧、I2C 输出电流/功率监控器; Supplier Part: C49851; Manufacturer: TI(德州仪器); Supplier Footprint: MSOP-10; JLCPCB Part Class: Extended Part; Datasheet: https://www.ti.com/cn/lit/gpn/ina226; Supplier: LCSC; Supply Voltage: 0V~36V; Operating Temperature: -40℃~+125℃
U5-U8 = AO4407_C5155210: 为高效电源开关、电池保护和负载管理应用设计，具备低导通电阻及卓越的开关性能，是各类中低压电路的理想选择，有效提升系统能效并确保稳定运行。; Supplier Part: C5155210; Manufacturer: JSMSEMI(杰盛微); Supplier Footprint: SOP-8; JLCPCB Part Class: Extended Part; Datasheet: https://atta.szlcsc.com/upload/public/pdf/source/20240105/4113167D4F242325956BD561B6FD9E61.pdf; Supplier: LCSC
U9 = TJA1050T/CM,118: 类型:收发器;; LCSC Part Name: 4.75V~5.25V; Supplier Part: C6952; Manufacturer: NXP(恩智浦); Supplier Footprint: SOP-8; JLCPCB Part Class: 扩展库; Datasheet: https://atta.szlcsc.com/upload/public/pdf/source/20140411/1457707042917.pdf; Supplier: LCSC; Type: 收发器; Supply Voltage: 4.75V~5.25V; Supply Current: 50mA
U10 = FM8254AAV: Supplier Part: C255540; Manufacturer: FM(富满); Supplier Footprint: TSSOP-16; JLCPCB Part Class: 扩展库; Datasheet: https://atta.szlcsc.com/upload/public/pdf/source/20180817/C255542_4215B90E04D6BB589BE1EB64F6B9F3AF.pdf; Supplier: LCSC
U11 = CN3722: Supplier Part: C77905; Manufacturer: CONSONANCE(上海如韵); Supplier Footprint: TSSOP-16; JLCPCB Part Class: 扩展库; Datasheet: https://atta.szlcsc.com/upload/public/pdf/source/20161217/1481939130627.pdf; Supplier: LCSC
U12 = ZX-XH2.54-5PWZ: 插针结构:1x5P;间距:2.54mm;安装方式:弯插;参考系列:XH;总PIN数:5P;排数:1;每排PIN数:5;行距:-;额定电流:3A;触头材质:黄铜;触头镀层:锡;工作温度范围:-25℃~+85℃;; Supplier Part: C7429644; Manufacturer: Megastar(兆星); Supplier Footprint: 弯插,P=2.54mm; JLCPCB Part Class: 扩展库; Datasheet: https://atta.szlcsc.com/upload/public/pdf/source/20230619/D9E5E4222EDAC56B190563A646F17377.pdf; Supplier: LCSC; Pins Structure: 1x5P; Pitch: 2.54mm; Mounting Style: 弯插; Reference Series: XH; Number of Pins: 5P; Number of Rows: 1; Number of PINs Per Row: 5; Current Rating (Max): 3A; Contact Material: 黄铜; Contact Plating: 锡; Operating Temperature Range: -25℃~+85℃
X1 = X50328MSB2GI: 晶振类型:贴片晶振;频率:8MHz;常温频差:±10ppm;外接负载电容:20pF;频率稳定度(全温):±20ppm;; LCSC Part Name: 8MHz ±10ppm 20pF YSX530GA; Supplier Part: C115962; Manufacturer: YXC(扬兴晶振); Supplier Footprint: SMD5032; JLCPCB Part Class: 基础库; Datasheet: https://atta.szlcsc.com/upload/public/pdf/source/20240329/44922B0AF7B60E58E9B66993B6077277.pdf; Supplier: LCSC; Crystal Type: 贴片晶振; Normal temperature Frequency Tolerance: ±10ppm; External load capacitor: 20pF; Frequency Stability(Full temperature range): ±20ppm; Operating Temperature: -40℃~+85℃

## Nets
AGND: R33.1 R38.1 R67.1 R70.1
GND: C2.2 C3.1 C4.1 C7.1 C9.1 C10.1 C12.1 C13.1 C14.1 C15.1 C16.1 C17.1 C18.1 C21.1 C26.1 C32.1 C36.1 C38.1 C39.1 C40.1 C41.2 C44.2 C45.1 C46.2 C47.2 CN7.2 CN10.2 CN11.a3 CN11.a4 CN11.b3 CN11.b4 D8.1(A) H3.1 H6.1 H8.1 H9.1 H10.1 LED19.2(-) LED20.2(-) LED21.2(-) LED26.2(-) LED27.2(-) Q4.2(E) Q14.2(E) R12.2 R58.2 R60.1 R67.2 R68.2 R70.2 SW1.1 U1.2(GND) U2.1(ADJ/GND) U3.8(VSSA) U3.23(VSS) U3.35(VSS) U3.47(VSS) U4.1(A1) U4.2(A0) U4.7(GND) U9.2(GND) U9.8(S) U11.2(PGND) U11.3(GND) U12.3
V3.3V: C7.2 C13.2 C14.2 C15.2 C16.2 C41.1 C47.1 CN11.a9 CN11.b9 R1.2 R2.2 R3.2 R4.2 R7.2 R15.2 R16.2 R62.2 R71.2 U2.2(VOUT) U2.4(VOUT) U3.1(VBAT) U3.9(VDDA) U3.24(VDD) U3.36(VDDIO2) U3.48(VDD) U12.5
V5V: C4.2 C21.2 C26.2 C44.1 CN11.a8 CN11.b8 R40.1 U1.3(Out) U4.6(VS+) U9.3(VCC)
VBUS: CN2.2 CN11.a5 CN11.a6 CN11.b5 CN11.b6 F1.1 F2.1 Q2.2(S) Q13.2(S) R9.2 R39.1 R63.2
VCC: C20.1 CN2.1 CN11.a1 CN11.a2 CN11.b1 CN11.b2 R17.2 U4.8(VBUS) U4.9(VIN-)
ADC5: C9.2 H3.2 R4.1 U3.15(PA5)
ADC6: C40.2 H9.2 R62.1 U3.16(PA6)
ADC7: C12.2 H6.2 R7.1 U3.17(PA7)
B1: B3.2 B4.1 R27.1
B2: B2.2 B3.1 R26.1
B3: B1.2 B2.1 R25.1
B+: B1.1 C22.2 C23.2 C24.2 C25.2 C48.2 R24.1 R31.1 U6.1(S) U6.2(S) U6.3(S) U8.1(S) U8.2(S) U8.3(S) U10.16(VDD)
B-: B4.2 R32.1 R34.1 R38.2
CAN_H: CN11.a12 CN11.b12 U9.7(CANH)
CAN_L: CN11.a13 CN11.b13 U9.6(CANL)
CAN_RX: U3.32(PA11) U9.4(RXD)
CAN_TX: U3.33(PA12) U9.1(TXD)
I2C_SCL_BUS: CN11.a10 CN11.b10 U3.21(PB10)
I2C_SDA_BUS: CN11.a11 CN11.b11 U3.22(PB11)
LEDG: LED22.2(K) U3.41(PB5)
LEDR: LED25.2(-) U3.42(PB6)
NRST: C10.2 CN11.a14 R1.1 SW1.2 U3.7(NRST) U12.1
P+: C32.2 C35.2 D6.1(A) D6.3(A) R20.2 R21.1 R44.1 R55.1 U5.1(S) U5.2(S) U5.3(S) U7.1(S) U7.2(S) U7.3(S) U11.14(BAT)
SCL1: R15.1 U3.30(PA9) U4.5(SCL)
SDA1: R16.1 U3.31(PA10) U4.4(SDA)
SW0: R64.2 U3.38(PA15)
SW1: R14.2 U3.46(PB9)
SWCLK: CN11.a15 U3.37(PA14) U12.2
SWDIO: H12.1 U3.34(PA13) U12.4
SWDIO_BUS: CN11.a16 CN11.b16 H12.2
UART2_RX: CN11.b14 U3.13(PA3)
UART2_TX: CN11.b15 U3.12(PA2)
UART5_RX: CN10.4 U3.40(PB4)
UART5_TX: CN10.3 U3.39(PB3)
VC1: C22.1 R24.2 U10.15(VC1)
VC2: C23.1 R25.2 U10.14(VC2)
VC3: C24.1 R26.2 U10.13(VC3)
VC4: C25.1 R27.2 U10.12(VC4)
VSOLAR: C34.1 CN7.1 CN11.a7 CN11.b7 LED23.1(A) LED24.1(+) Q11.2(S) R53.2 U11.15(VCC)
$1N3705: R12.1 U3.44(PF11-BOOT0)
$1N4664: C18.2 U3.6(PF1_OSC32_OUT) X1.2(OSC2)
$1N4673: C17.2 U3.5(PF0_OSC32_IN) X1.1(OSC1)
$1N5322: LED25.1(+) R2.1
$1N5324: LED22.1(A) R3.1
$1N6913: LED26.1(+) R11.2
$1N6914: H8.2 Q2.3(D) R11.1
$1N6917: Q2.1(G) Q4.3(C) R9.1
$1N6919: Q4.1(B) R14.1
$1N8647: C34.2 U11.1(VG)
$1N8648: Q11.1(G) U11.16(DRV)
$1N8650: R54.1 U11.5(DONE#)
$1N8651: LED23.2(K) R54.2
$1N8653: R58.1 U11.6(TEMP)
$1N8654: R53.1 R60.2 U11.7(MPPT)
$1N8657: C38.2 U11.8(COM1)
$1N8658: D7.1(A) Q11.3(D)
$1N8659: D7.2(K) D8.2(K) L1.1
$1N8664: C36.2 U11.11(COM3)
$1N8666: C39.2 R59.2
$1N8668: R59.1 U11.9(COM2)
$1N8669: C35.1 R55.2 R61.1 U11.10(FB)
$1N13839: U5.5(D) U5.6(D) U5.7(D) U5.8(D) U6.5(D) U6.6(D) U6.7(D) U6.8(D) U7.5(D) U7.6(D) U7.7(D) U7.8(D) U8.5(D) U8.6(D) U8.7(D) U8.8(D)
$1N14323: R22.2 U10.3(DOP)
$1N14342: R22.1 U6.4(G) U8.4(G)
$1N14974: R31.2 U10.10(SEL)
$1N15062: R32.2 U10.11(CTL)
$1N15216: R21.2 U5.4(G) U7.4(G) U10.1(COP)
$1N15258: R20.1 U10.2(VMP)
$1N15281: C27.2 U10.5(CDT)
$1N15285: C28.2 U10.6(CCT)
$1N15289: C27.1 C28.1 C48.1 R34.2 U10.7(VSS)
$1N15300: R33.2 U10.4(VINI)
$1N15382: L1.2 R44.2 U11.13(CSP)
$1N18401: LED19.1(+) R39.2
$1N18481: LED20.1(+) R40.2
$1N27506: C20.2 D6.2(K) R17.1 U4.10(VIN+)
$1N113442: LED27.1(+) R65.2
$1N113445: Q13.1(G) Q14.3(C) R63.1
$1N113447: Q14.1(B) R64.1
$1N113450: H10.2 Q13.3(D) R65.1
$1N168546: R61.2 R68.1
$1N218502: R69.1 U11.4(CHRG#)
$1N218632: LED21.1(+) R71.1
$1N219757: D9.1(A) F1.2
$1N219761: C2.1 C3.2 D9.2(K) U1.1(IN)
$1N219976: D10.1(A) F2.2
$1N223683: LED24.2(-) R69.2
$1N223906: C45.2 C46.1 D10.2(K) U2.3(VIN)

Not connected (* = marked no-connect by the designer): CN10 1*; H12 3*; U3 2(PC13)* 3(PC14_OSC32_IN)* 4(PC15_OSC32_OUT)* 10(PA0)* 11(PA1)* 14(PA4)* 18(PB0)* 19(PB1)* 20(PB2)* 25(PB12)* 26(PB13)* 27(PB14)* 28(PB15)* 29(PA8)* 43(PB7)* 45(PB8)*; U4 3(Alert)*; U9 5(VREF)*; U10 8(NC)* 9(NC)*; U11 12(NC)*

## Notes on the sheet
- 总线接口
- 上电复位
- 工作指示灯
- EPS板工作电源
- 电源板温度检测与控制
- 烧录跳线口
- 电源开关
- 电池温度检测与加热
- 电源输出功率检测
- 调试串口
- CAN
- 电池保护电路
- 程序下载接口
- 输出电源显示
- MPPT充电
- 相对第一版改进：
  1、晶振电路中修改了起振电容值，原来为100nF，现在为20pF
  2、删除了太阳能充电接口、充电功率检测电路、电池组电压检测电路、三路电压输出控制电路
  3、在5VLDO输入端增加额定电流为2A的保险丝（一次性，快断型）和一个肖特基二极管，在3.3VLDO输入端增加额定电流为1A的保险丝和一个肖特基二极管，电源输入端使用额定电流为10A的肖特基二极管（防反接）
  4、总线接口更改，增加了电源VCC总线、充电总线及烧录总线、UART串口总线
  5、MPPT充电电路反馈电阻Rcs修改为200mΩ，对应的充电电流为1A，添加了充电指示灯（充电时为红灯，充满时为绿灯）
